# EAGLE design board (EAGLE 6.4)
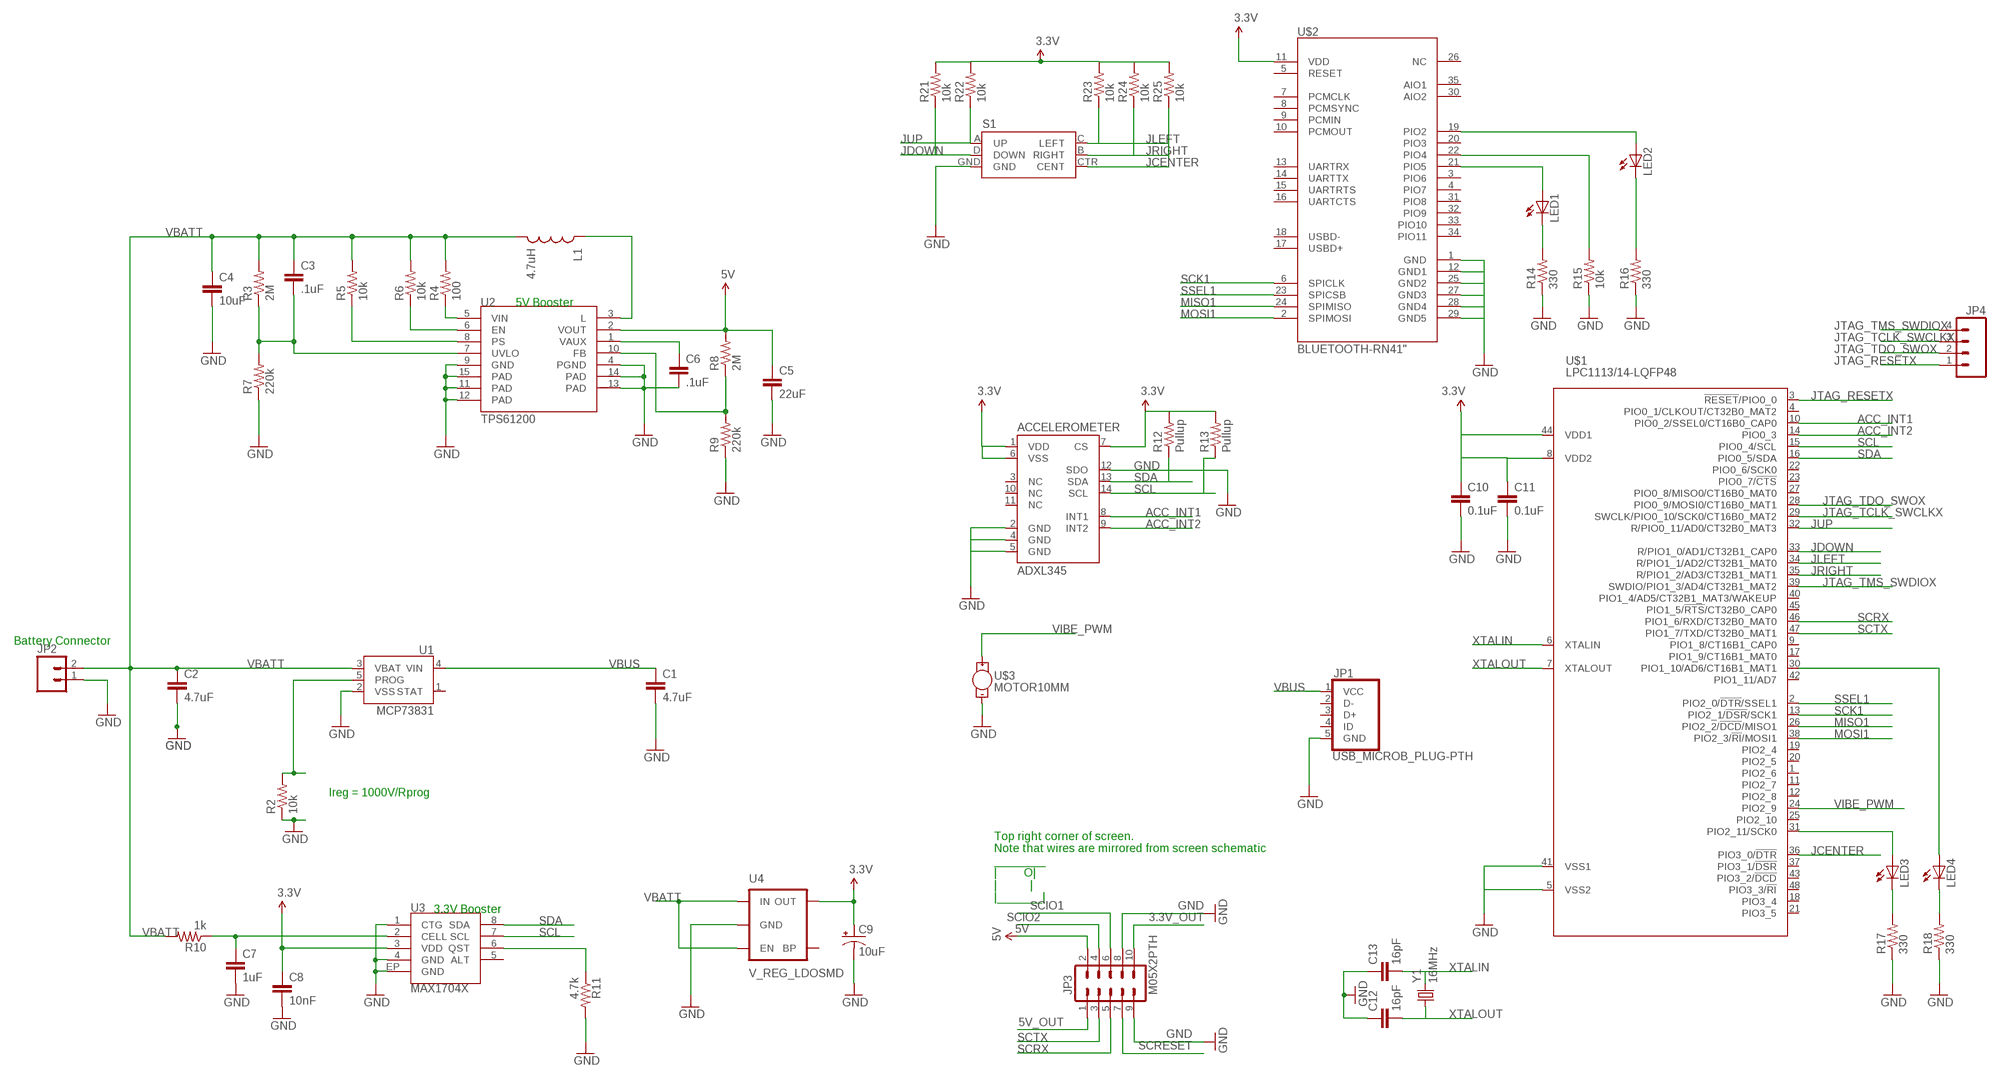
[diagram p0: schematic, sheet 1]

## Parts
ACCELEROMETER  ADXL345  [LGA14]
C1  4.7uF  CAP0402-CAP  [0402-CAP]
C2  4.7uF  CAP0402-CAP  [0402-CAP]
C3  .1uF  CAP0402-CAP  [0402-CAP]
C4  10uF  CAP0402-CAP  [0402-CAP]
C5  22uF  CAP0402-CAP  [0402-CAP]
C6  .1uF  CAP0402-CAP  [0402-CAP]
C7  1uF  CAP0402-CAP  [0402-CAP]
C8  10nF  CAP0402-CAP  [0402-CAP]
C9  10uF  10UF-TANT  [EIA3216]
C10  0.1uF  .1UF-CER  [0402-CAP]
C11  0.1uF  .1UF-CER  [0402-CAP]
C12  16pF  CAP0402-CAP  [0402-CAP]
C13  16pF  CAP0402-CAP  [0402-CAP]
JP1  USB_MICROB_PLUG-PTH  [MICRO-B-RA-TH]
JP2  M02-JST-2-PTH-NO_SILK  [JST-2-PTH-NS]
JP3  M05X2PTH  [AVR_ICSP]
JP4  M04POLAR  [MOLEX-1X4]
L1  4.7uH  INDUCTOR0402  [C0402]
LED1  LED0603  [LED-0603]
LED2  LED0603  [LED-0603]
LED3  LED0603  [LED-0603]
LED4  LED0603  [LED-0603]
R2  10k  RESISTOR0402-RES  [0402-RES]
R3  2M  RESISTOR0402-RES  [0402-RES]
R4  100  RESISTOR0402-RES  [0402-RES]
R5  10k  RESISTOR0402-RES  [0402-RES]
R6  10k  RESISTOR0402-RES  [0402-RES]
R7  220k  RESISTOR0402-RES  [0402-RES]
R8  2M  RESISTOR0402-RES  [0402-RES]
R9  220k  RESISTOR0402-RES  [0402-RES]
R10  1k  RESISTOR0402-RES  [0402-RES]
R11  4.7k  RESISTOR0402-RES  [0402-RES]
R12  Pullup  RESISTOR0402-RES  [0402-RES]
R13  Pullup  RESISTOR0402-RES  [0402-RES]
R14  330  RESISTOR0402-RES  [0402-RES]
R15  10k  RESISTOR0402-RES  [0402-RES]
R16  330  RESISTOR0402-RES  [0402-RES]
R17  330  RESISTOR0402-RES  [0402-RES]
R18  330  RESISTOR0402-RES  [0402-RES]
R21  10k  RESISTOR0402-RES  [0402-RES]
R22  10k  RESISTOR0402-RES  [0402-RES]
R23  10k  RESISTOR0402-RES  [0402-RES]
R24  10k  RESISTOR0402-RES  [0402-RES]
R25  10k  RESISTOR0402-RES  [0402-RES]
S1  JOYSTICK_MINI  [JOYSTICK_MINI]
U1  MCP73831  [SOT23-5]
U2  TPS61200  [QFN-10_PAD]
U3  MAX1704X  [TDFN-8]
U4  V_REG_LDOSMD  [SOT23-5]
U$1  LPC1113/14-LQFP48  [LQFP48]
U$2  BLUETOOTH-RN41"  [RN41]
U$3  MOTOR10MM  [VIBE-MOTOR-10MM]
Y1  16MHz  CRYSTAL5X3  [CRYSTAL-SMD-5X3]

## Nets
3.3V: ACCELEROMETER.1(VDD) ACCELEROMETER.6(VSS) ACCELEROMETER.7(CS) C8.1 C9.A(+) C10.1 C11.1 R12.2 R13.2 R21.2 R22.2 R23.2 R24.2 R25.2 U3.3(VDD) U4.5(OUT) U$1.8(VDD2) U$1.44(VDD1) U$2.11(VDD)
3.3V_OUT: JP3.10
5V: C5.1 JP3.2 R8.2 U2.2(VOUT)
5V_OUT: JP3.1
ACC_INT1: ACCELEROMETER.8(INT1) U$1.10(PIO0_2/SSEL0/CT16B0_CAP0)
ACC_INT2: ACCELEROMETER.9(INT2) U$1.14(PIO0_3)
GND: ACCELEROMETER.2(GND) ACCELEROMETER.4(GND) ACCELEROMETER.5(GND) ACCELEROMETER.12(SDO) C1.2 C2.2 C4.2 C5.2 C6.2 C7.2 C8.2 C9.C(-) C10.2 C11.2 C12.1 C13.1 JP1.5(GND) JP2.1 JP3.8 JP3.9 R2.1 R7.1 R9.1 R11.2 R14.1 R15.1 R16.1 R17.1 R18.1 S1.GND U1.2(VSS) U2.4(PGND) U2.9(GND) U2.11(PAD) U2.12(PAD) U2.13(PAD) U2.14(PAD) U2.15(PAD) U3.1(CTG) U3.4(GND) U3.EP(GND) U4.2(GND) U$1.5(VSS2) U$1.41(VSS1) U$2.1(GND) U$2.12(GND1) U$2.25(GND2) U$2.27(GND3) U$2.28(GND4) U$2.29(GND5) U$3.-
JCENTER: R25.1 S1.CTR(CENT) U$1.36(PIO3_0/!DTR!)
JDOWN: R21.1 S1.D(DOWN) U$1.33(R/PIO1_0/AD1/CT32B1_CAP0)
JLEFT: R23.1 S1.C(LEFT) U$1.34(R/PIO1_1/AD2/CT32B1_MAT0)
JRIGHT: R24.1 S1.B(RIGHT) U$1.35(R/PIO1_2/AD3/CT32B1_MAT1)
JTAG_RESETX: JP4.1 U$1.3(!RESET!/PIO0_0)
JTAG_TCLK_SWCLKX: JP4.3 U$1.29(SWCLK/PIO0_10/SCK0/CT16B0_MAT2)
JTAG_TDO_SWOX: JP4.2 U$1.28(PIO0_9/MOSI0/CT16B0_MAT1)
JTAG_TMS_SWDIOX: JP4.4 U$1.39(SWDIO/PIO1_3/AD4/CT32B1_MAT2)
JUP: R22.1 S1.A(UP) U$1.32(R/PIO0_11/AD0/CT32B0_MAT3)
MISO1: U$1.26(PIO2_2/!DCD!/MISO1) U$2.24(SPIMISO)
MOSI1: U$1.38(PIO2_3/!RI!/MOSI1) U$2.2(SPIMOSI)
N$1: LED2.A U$2.19(PIO2)
N$2: R2.2 U1.5(PROG)
N$3: C3.2 R3.1 R7.2 U2.7(UVLO)
N$4: C6.1 U2.1(VAUX)
N$5: R6.1 U2.6(EN)
N$6: R5.1 U2.8(PS)
N$7: L1.1 U2.3(L)
N$8: R8.1 R9.2 U2.10(FB)
N$9: C7.1 R10.1 U3.2(CELL)
N$10: R11.1 U3.6(QST)
N$11: R15.2 U$2.22(PIO4)
N$12: LED1.A U$2.21(PIO5)
N$13: LED1.C R14.2
N$14: LED2.C R16.2
N$15: LED3.A U$1.31(PIO2_11/SCK0)
N$16: LED4.A U$1.30(PIO1_10/AD6/CT16B1_MAT1)
N$17: LED3.C R17.2
N$18: LED4.C R18.2
SCIO1: JP3.6
SCIO2: JP3.4
SCK1: U$1.13(PIO2_1/!DSR!/SCK1) U$2.6(SPICLK)
SCL: ACCELEROMETER.14(SCL) R13.1 U3.7(SCL) U$1.15(PIO0_4/SCL)
SCRESET: JP3.7
SCRX: JP3.5 U$1.46(PIO1_6/RXD/CT32B0_MAT0)
SCTX: JP3.3 U$1.47(PIO1_7/TXD/CT32B0_MAT1)
SDA: ACCELEROMETER.13(SDA) R12.1 U3.8(SDA) U$1.16(PIO0_5/SDA)
SSEL1: U$1.2(PIO2_0/!DTR!/SSEL1) U$2.23(SPICSB)
VBATT: C2.1 C3.1 C4.1 JP2.2 L1.2 R3.2 R4.2 R5.2 R6.2 R10.2 U1.3(VBAT) U4.1(IN) U4.3(EN)
VBUS: C1.1 JP1.1(VCC) U1.4(VIN)
VIBE_PWM: U$1.24(PIO2_9) U$3.+
VIN: R4.1 U2.5(VIN)
XTALIN: C13.2 U$1.6(XTALIN) Y1.3
XTALOUT: C12.2 U$1.7(XTALOUT) Y1.1
Unconnected: ACCELEROMETER.3(NC) ACCELEROMETER.10(NC) ACCELEROMETER.11(NC) JP1.2(D-) JP1.3(D+) JP1.4(ID) U1.1(STAT) U3.5(ALT) U4.4(BP) U$1.1(PIO2_6) U$1.4(PIO0_1/CLKOUT/CT32B0_MAT2) U$1.9(PIO1_8/CT16B1_CAP0) U$1.11(PIO2_7) U$1.12(PIO2_8) U$1.17(PIO1_9/CT16B1_MAT0) U$1.18(PIO3_4) U$1.19(PIO2_4) U$1.20(PIO2_5) U$1.21(PIO3_5) U$1.22(PIO0_6/SCK0) U$1.23(PIO0_7/!CTS!) U$1.25(PIO2_10) U$1.27(PIO0_8/MISO0/CT16B0_MAT0) U$1.37(PIO3_1/!DSR!) U$1.40(PIO1_4/AD5/CT32B1_MAT3/WAKEUP) U$1.42(PIO1_11/AD7) U$1.43(PIO3_2/!DCD!) U$1.45(PIO1_5/!RTS!/CT32B0_CAP0) U$1.48(PIO3_3/!RI!) U$2.3(PIO6) U$2.4(PIO7) U$2.5(RESET) U$2.7(PCMCLK) U$2.8(PCMSYNC) U$2.9(PCMIN) U$2.10(PCMOUT) U$2.13(UARTRX) U$2.14(UARTTX) U$2.15(UARTRTS) U$2.16(UARTCTS) U$2.17(USBD+) U$2.18(USBD-) U$2.20(PIO3) U$2.26(NC) U$2.30(AIO2) U$2.31(PIO8) U$2.32(PIO9) U$2.33(PIO10) U$2.34(PIO11) U$2.35(AIO1)

## Notes on the sheet
- 5V Booster
- Battery Connector
- Ireg = 1000V/Rprog
- Top right corner of screen. 
  Note that wires are mirrored from screen schematic
  ________
  |         O|
  |           |
  |_______|
- 3.3V Booster

## Library data of the parts
ACCELEROMETER = SparkFun-Sensors:ADXL345: 3-axis SPI/I2C 2/4/8/16g accelerometer
C1-C8 C12 C13 = SparkFun-Passives:CAP: Capacitor Standard 0603 ceramic capacitor, and 0.1" leaded capacitor.
C9 = SparkFun-Capacitors:10UF-TANT: 10uF Tantalum SMT CAP-00811- 16V 10% (EIA-3216); PROD_ID: CAP-00811
C10 C11 = SparkFun-Capacitors:.1UF-CER: .1uF ceramic SMT CAP-00810- 25V +80%/-20% (0603) CAP-08390- 100V 10% (0603) CAP-08604- 25V 5% (0603); PROD_ID: CAP-00810
JP1 = SparkFun-Connectors:USB_MICROB_PLUG: USB Micro-B Plug Comes in a variety of packages. Check out Hirose's ZX-x0 line: http://www.hirose.co.jp/cataloge_hp/e24200011.pdf
JP2 = SparkFun-Connectors:M02: Header 2 Standard 2-pin 0.1" header. Use with straight break away headers (SKU : PRT-00116), right angle break away headers (PRT-00553), swiss pins (PRT-00743), machine pins (PRT-00117), and female headers (PRT-00115). Molex polarized connector foot print use with SKU : PRT-08233 with associated crimp pins and housings.
JP3 = SparkFun-Connectors:M05X2: Header 5x2 Standard 10-pin dual row 0.1" header. Commonly used with AVR-ISP. Use with Spark Fun Electronics SKU: PRT-00778
JP4 = SparkFun-Connectors:M04: Header 4 Standard 4-pin 0.1" header. Use with straight break away headers (SKU : PRT-00116), right angle break away headers (PRT-00553), swiss pins (PRT-00743), machine pins (PRT-00117), and female headers (PRT-00115). Molex polarized connector foot print use with SKU : PRT-08231 with associated crimp pins and housings. 1MM SMD Version SKU: PRT-10208
L1 = SparkFun-Passives:INDUCTOR: Inductors Basic Inductor/Choke - 0603 and 1206. Footprints are not proven and vary greatly between part numbers.
LED1-LED4 = SparkFun-LED:LED: LEDs Standard schematic elements and footprints for 5mm, 3mm, 1206, and 0603 sized LEDs. 5mm - Spark Fun Electronics SKU : COM-00529 (and others)
R2-R18 R21-R25 = SparkFun-Passives:RESISTOR: Resistor Basic schematic elements and footprints for 0603, 1206, and PTH resistors.
S1 = SparkFun-Electromechanical:JOYSTICK_MINI: Small 5-way tactile joystick, COM-10063 4UCON SF303GJ26
U1 = SparkFun-PowerIC:MCP73831: Miniature single cell, fully integrated Li-Ion, Li-polymer charge management controller http://ww1.microchip.com/downloads/en/DeviceDoc/21984a.pdf IC-09995; PROD_ID: IC-09995
U2 = SparkFun-PowerIC:TPS61200: DC to DC Booster IC-10035; PROD_ID: IC-10035
U3 = SparkFun-PowerIC:MAX1704X: MAX17043/MAX17044: Battery Fuel Guage (43 is 1cell, 44 is 2cell)
U4 = SparkFun-PowerIC:V_REG_LDO: Voltage Regulator LDO Standard 150mA LDO voltage regulator in SOT-23 layout. Micrel part MIC5205. BP (by-pass) pin is used to lower output noise with 470pF cap.
U$1 = lpc1100v1.1:LPC1113/14-LQFP48: NXP Semiconductors LPC11xx microcontrollers <http://ics.nxp.com/products/lpc1000/lpc11xx/> ARM 32-bit Cortex-M0 Microcontroller with MPU CPU clock up to 50MHz Up to 32KByte on-chip Flash ROM with In-System Programming (ISP) and In-Application Programming (IAP) via On-Chip Bootloader Up to 8KByte SRAM Nested Vectored Interrupt Controller Up to 2 SPI controllers UART with full Modem Interface and RS485 Support Fast Mode I2C-Bus 4 Timers with 4 capture channels and 13 output channels Watchdog (WDT) Sytem tick timer 10-bit ADC with 8 channels Power Management Unit (PMU) Brownout detection 12MHz internal RC oscillator Serial Wire Debug/Trace port
U$2 = SparkFun-RF:BLUETOOTH-RN41: Bluetooth SMD module
U$3 = SparkFun-Electromechanical:MOTOR: Vibration Motor- ROB-08449 Physical dimension and wire connections for this powerful vibration motor. Motor has a self adhesive backing.
Y1 = SparkFun-FreqCtrl:CRYSTAL: Various standard crystals. Proven footprints. Spark Fun Electronics SKU : COM-00534

## Board
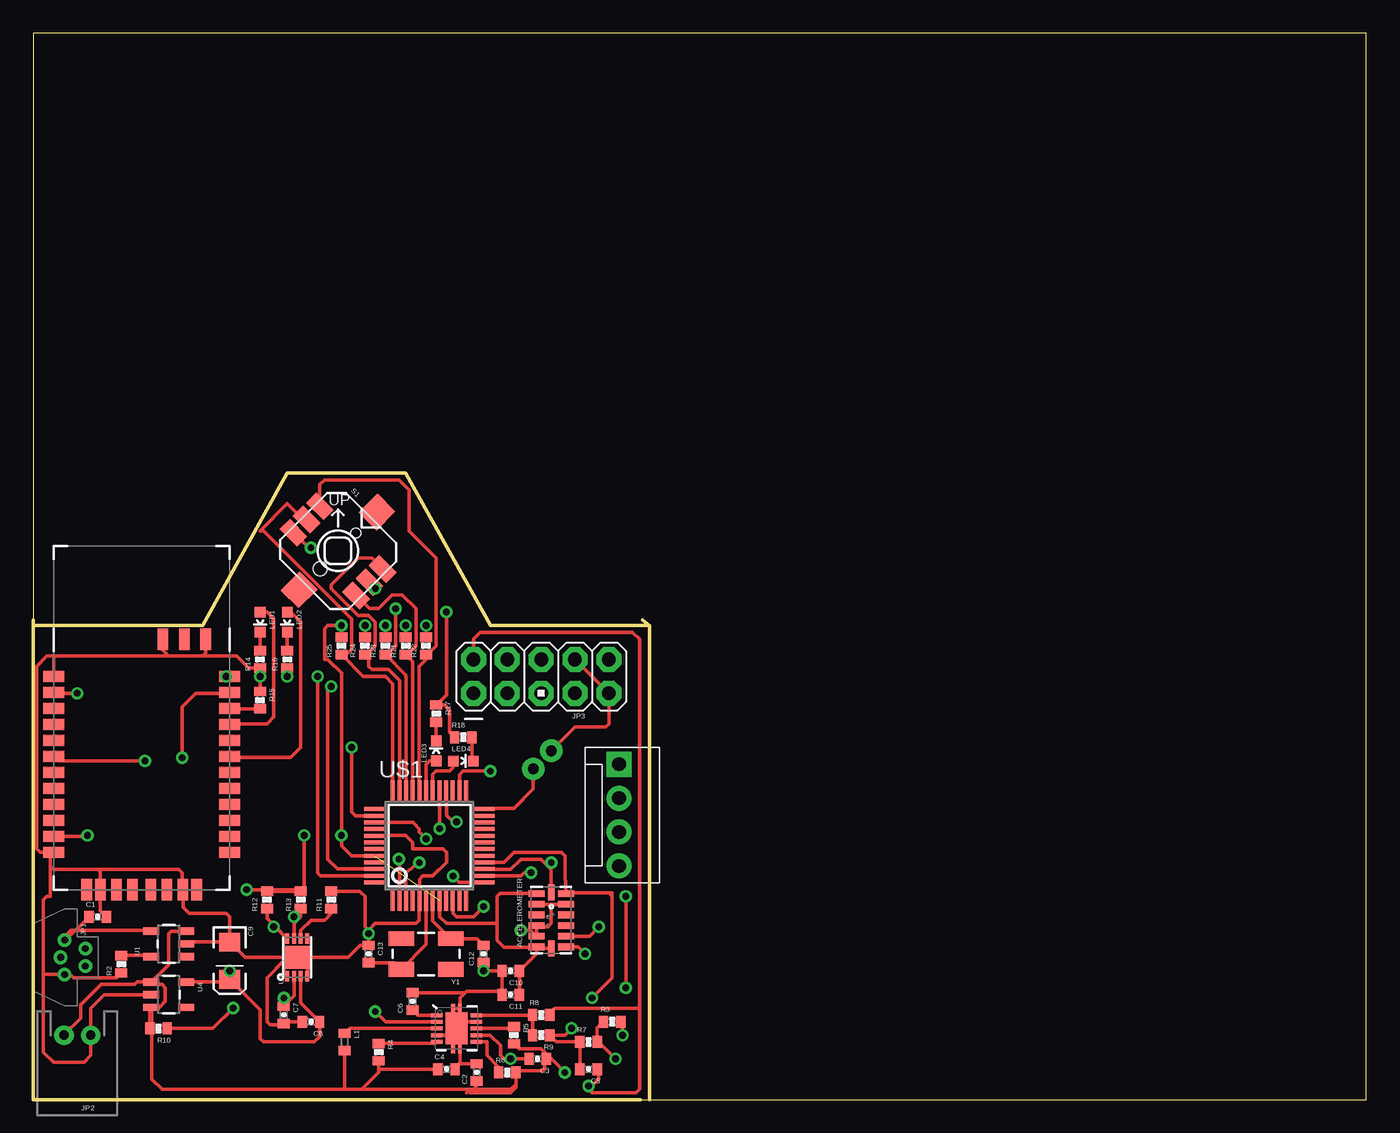
[diagram p1: board, top side]
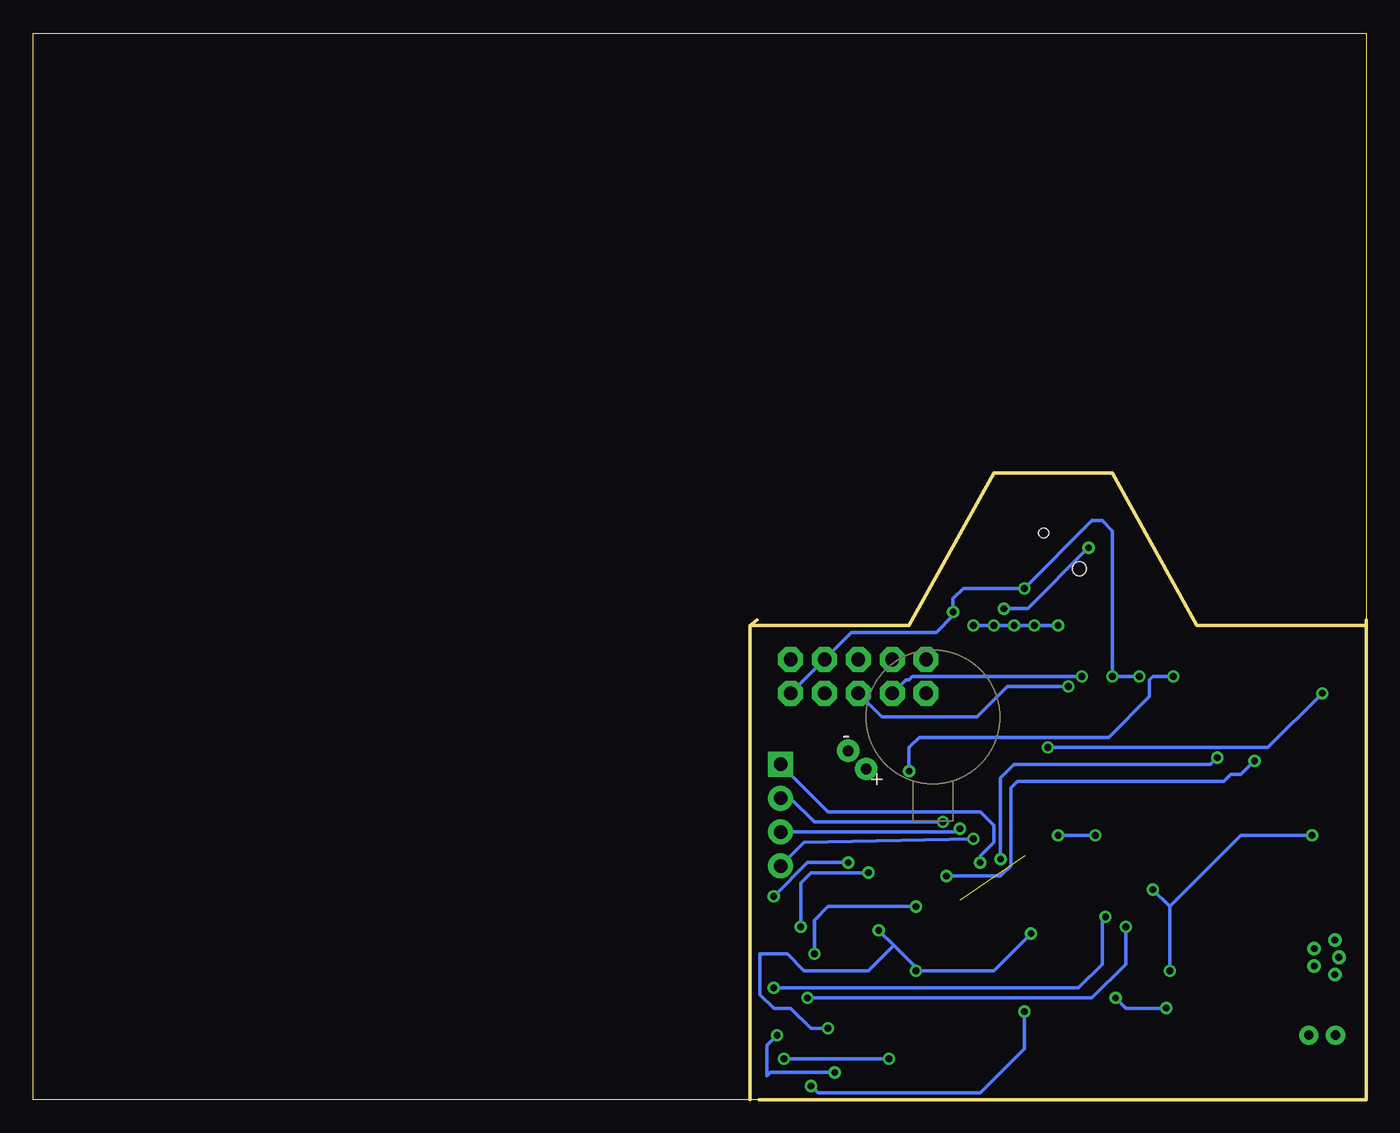
[diagram p2: board, bottom side, seen from below]

Size 100 x 80 mm. Coordinates in mm from the lower left corner, seen from the top.
Outline: 46.23,0 45.56,0 0,0 0,35.56
Outline: 46.23,0 100,0 100,80 0,80 0,36 0,35.56
Outline: 46.23,0 46.23,35.56
Outline: 46.23,35.56 45.72,36
Outline: 0,35.56 12.7,35.56 19.05,46.99 27.94,46.99 34.29,35.56 46.23,35.56
Copper layers (1*16): Top 0.035mm / dielectric 1.5mm / Bottom 0.035mm
Design rules "default": minimum track width 10mil, minimum drill 24mil, track to track 8mil, track to pad 8mil, pad to pad 8mil, via to via 8mil, smd to smd 8mil, copper to edge 40mil, drill to drill 8mil, minimum pad ring 10mil, minimum via ring 8mil, stop-mask expansion 4mil, vias tented up to drill 0mil, thermal gap 10mil

### Footprints (pad centres in the part's own frame; a part is rotated, then mirrored left to right if it is on the bottom)
LGA14 = smd 0.5 x 1.2: 1 2,1.1; 2 1.2,1.1; 3 0.4,1.1; 4 -0.4,1.1; 5 -1.2,1.1; 6 -2,1.1; 8 -2,-1.1; 9 -1.2,-1.1; 10 -0.4,-1.1; 11 0.4,-1.1; 12 1.2,-1.1; 13 2,-1.1 | smd 1.2 x 0.5: 7 -2.1,0; 14 2.1,0
0402-CAP = smd 0.7 x 0.9: 1 -0.65,0; 2 0.65,0
EIA3216 = smd 1.4 x 1.6: A 1.4,0; C -1.4,0
MICRO-B-RA-TH = drill 0.508 pad 0.9: 1 -1.3,-0.95; 2 -0.65,0.6; 3 0,-1.25; 4 0.65,0.6; 5 1.3,-0.95
JST-2-PTH-NS = drill 0.7 pad 1.448: 1 -1,0; 2 1,0
AVR_ICSP = drill 1.016 pad 1.88 octagon: 1 -1.27,5.08; 2 1.27,5.08; 3 -1.27,2.54; 4 1.27,2.54; 5 -1.27,0; 6 1.27,0; 7 -1.27,-2.54; 8 1.27,-2.54; 9 -1.27,-5.08; 10 1.27,-5.08
MOLEX-1X4 = drill 1.016 pad 1.88 square: 1 0,0 | drill 1.016 pad 1.88: 2 2.54,0; 3 5.08,0; 4 7.62,0
C0402 = smd 0.7 x 0.9: 1 -0.65,0; 2 0.65,0
LED-0603 = smd 0.8 x 0.8: A 0,-0.75; C 0,0.75
0402-RES = smd 0.7 x 0.9: 1 -0.65,0; 2 0.65,0
JOYSTICK_MINI = smd 1.85 x 1.1: A -3.325,1.4; B 3.325,1.4; C -3.325,-1.4; CTR -3.325,0; D 3.325,-1.4; GND 3.325,0 | smd 1.9 x 2: NC 0,4.13; NC@0 0,-4.13 | hole 0.75: 0,1.9 | hole 1.05: 0,-1.9
SOT23-5 = smd 0.55 x 1.2: 1 -0.95,-1.3; 2 0,-1.3; 3 0.95,-1.3; 4 0.95,1.3; 5 -0.95,1.3
QFN-10_PAD = smd 0.297 x 0.85: 1 -1,-1.475; 2 -0.5,-1.475; 3 0,-1.475; 4 0.5,-1.475; 5 1,-1.475; 6 1,1.475; 7 0.5,1.475; 8 0,1.475; 9 -0.5,1.475; 10 -1,1.475 | smd 0.7 x 0.28: 11 -1.5,0.25; 12 -1.5,-0.25; 13 1.5,0.25; 14 1.5,-0.25 | smd 2.4 x 1.65: 15 0,0
TDFN-8 = smd 0.8 x 0.3: 1 -1.4,0.75; 2 -1.4,0.25; 3 -1.4,-0.25; 4 -1.4,-0.75; 5 1.4,-0.75; 6 1.4,-0.25; 7 1.4,0.25; 8 1.4,0.75 | smd 1.73 x 1.88: EP 0,0
LQFP48 = smd 0.3 x 1.6: 1 -2.75,-4.1; 2 -2.25,-4.1; 3 -1.75,-4.1; 4 -1.25,-4.1; 5 -0.75,-4.1; 6 -0.25,-4.1; 7 0.25,-4.1; 8 0.75,-4.1; 9 1.25,-4.1; 10 1.75,-4.1; 11 2.25,-4.1; 12 2.75,-4.1; 25 2.75,4.1; 26 2.25,4.1; 27 1.75,4.1; 28 1.25,4.1; 29 0.75,4.1; 30 0.25,4.1; 31 -0.25,4.1; 32 -0.75,4.1; 33 -1.25,4.1; 34 -1.75,4.1; 35 -2.25,4.1; 36 -2.75,4.1 | smd 1.6 x 0.3: 13 4.1,-2.75; 14 4.1,-2.25; 15 4.1,-1.75; 16 4.1,-1.25; 17 4.1,-0.75; 18 4.1,-0.25; 19 4.1,0.25; 20 4.1,0.75; 21 4.1,1.25; 22 4.1,1.75; 23 4.1,2.25; 24 4.1,2.75; 37 -4.1,2.75; 38 -4.1,2.25; 39 -4.1,1.75; 40 -4.1,1.25; 41 -4.1,0.75; 42 -4.1,0.25; 43 -4.1,-0.25; 44 -4.1,-0.75; 45 -4.1,-1.25; 46 -4.1,-1.75; 47 -4.1,-2.25; 48 -4.1,-2.75
RN41 = smd 0.8 x 1.6: 1 -6.6,-6.6; 2 -5.4,-6.6; 3 -4.2,-6.6; 4 -3,-6.6; 5 -1.8,-6.6; 6 -0.6,-6.6; 7 0.6,-6.6; 8 1.8,-6.6; 9 3,-6.6; 10 4.2,-6.6; 11 5.4,-6.6; 12 6.6,-6.6; 13 6.6,6.6; 14 5.4,6.6; 15 4.2,6.6; 16 3,6.6; 17 1.8,6.6; 18 0.6,6.6; 19 -0.6,6.6; 20 -1.8,6.6; 21 -3,6.6; 22 -4.2,6.6; 23 -5.4,6.6; 24 -6.6,6.6 | smd 1.6 x 0.8: 25 -9.4,4.8; 26 -9.4,3.2; 27 -9.4,1.6; 28 9.4,3.1; 29 9.4,-3.1; 30 9.4,-4.122; 31 9.4,-1.9; 32 9.4,-0.7; 33 9.4,0.7; 34 9.4,1.9; 35 9.4,4.122
VIBE-MOTOR-10MM = drill 0.8 pad 1.676: + -5,-3.9; - -6.35,-2.54
CRYSTAL-SMD-5X3 = smd 1.9 x 1.1: 1 -1.85,-1.15; 2 1.85,-1.15; 3 1.85,1.15; 4 -1.85,1.15

### Placement (x,y rotation side)
ACCELEROMETER  38.86,13.46 90 top
C1  4.83,13.72 0 top
C2  33.27,2.03 90 top
C3  37.85,3.05 180 top
C4  30.99,2.29 0 top
C5  41.66,2.29 180 top
C6  28.45,7.37 90 top
C7  18.8,6.35 270 top
C8  20.83,5.84 180 top
C9  14.73,10.41 270 top
C10  35.81,9.65 180 top
C11  35.81,7.87 180 top
C12  33.78,10.92 90 top
C13  25.15,10.92 270 top
JP1  3.3,10.67 270 top
JP2  3.3,4.83 180 top
JP3  38.1,31.75 90 top
JP4  43.94,25.15 270 top
L1  23.37,4.32 270 top
LED1  17.02,35.81 180 top
LED2  19.05,35.81 180 top
LED3  30.23,26.16 0 top
LED4  32.26,25.4 270 top
R2  6.6,10.16 90 top
R3  43.43,5.84 0 top
R4  25.91,3.56 270 top
R5  36.07,4.83 270 top
R6  35.56,2.03 0 top
R7  41.66,4.32 0 top
R8  38.1,6.35 0 top
R9  38.1,4.83 180 top
R10  9.4,5.33 180 top
R11  22.35,14.99 90 top
R12  17.53,14.99 90 top
R13  20.07,14.99 90 top
R14  17.02,33.02 90 top
R15  17.02,29.97 270 top
R16  19.05,33.02 90 top
R17  30.23,28.96 270 top
R18  32.26,27.18 0 top
R21  27.94,34.04 90 top
R22  29.46,34.04 90 top
R23  26.42,34.04 90 top
R24  24.89,34.04 90 top
R25  23.11,34.04 90 top
S1  22.86,41.17 315 top
U1  10.16,11.68 90 top
U2  31.75,5.33 270 top
U3  19.81,10.67 90 top
U4  10.16,7.87 270 top
U$1  29.72,19.05 0 top
U$2  8.13,25.15 270 top
U$3  32.51,28.7 0 bottom
Y1  29.46,10.92 180 top

### Tracks (layer width: path | path; a pad name or v marks a point on that pad's centre or on a via)
3.3V  (via drill 0.51)  (1 unrouted)
  Top 0.254: R25.2 v23.11,35.56 22.1,35.56 21.84,35.31 21.84,33.02 22.1,33.02 23.11,32 v23.11,19.81 23.11,19.05 23.88,18.29 25.61,18.29 U$1.44 | v24.89,35.56 R24.2 | R23.2 v26.42,35.56 | R21.2 v27.94,35.56 | R22.2 v29.46,35.56 | C9.A 14.54,8.82 U4.5 | R12.2 R13.2 | U3.3 20.06,7.26 C8.1 21.48,4.71 21.08,4.32 17.27,4.32 17.02,4.57 17.02,6.73 C9.A | R13.2 19.95,15.75 v16,15.75 | v14.73,9.65 C9.A | v4.06,19.81 4,19.75 U$2.11 | R13.2 20.32,15.89 v20.32,19.81 | ACCELEROMETER.6 37.86,11.36 ACCELEROMETER.7 | ACCELEROMETER.6 37.73,11.43 35.31,11.43 34.8,11.94 34.8,13.21 | 34.8,13.21 34.8,15.24 35.02,15.46 ACCELEROMETER.1 | U$1.8 30.48,14.94 30.48,13.72 30.99,13.21 34.8,13.21 | ACCELEROMETER.6 37.76,10.95 C10.1 36.46,8.27 36.32,8.13 36.32,8.02 C11.1
  Bottom 0.254: v23.11,35.56 v24.89,35.56 v26.42,35.56 v27.94,35.56 v29.46,35.56 | v16,15.75 14.73,14.48 | 14.73,14.48 v14.73,9.65 | 14.73,14.48 9.4,19.81 v4.06,19.81 | v20.32,19.81 v23.11,19.81
5V  (via drill 0.51)
  Top 0.254: JP3.2 33.02,34.54 33.53,35.05 44.96,35.05 45.47,34.54 45.47,6.86 | 45.47,6.86 45.47,0.76 45.21,0.51 41.91,0.51 41.66,0.76 v41.66,1.02 41.91,1.02 42.42,1.52 42.42,2.17 C5.1 | U2.2 26.42,5.83 v25.65,6.6 | R8.2 38.75,6.49 39.12,6.86 45.47,6.86
  Bottom 0.254: v25.65,6.6 25.65,3.81 28.96,0.51 41.15,0.51 v41.66,1.02
ACC_INT1  (via drill 0.51)
  Top 0.254: U$1.10 31.5,14.98 | 31.5,14.98 31.5,14.99 | 31.5,14.98 31.5,13.97 31.75,13.72 33.02,13.72 v33.78,14.48 | v41.4,10.92 40.86,11.46 ACCELEROMETER.8
  Bottom 0.254: v33.78,14.48 40.39,14.48 41.4,13.46 v41.4,10.92
ACC_INT2  (via drill 0.51)
  Top 0.254: U$1.14 33.85,16.76 36.58,16.76 36.83,17.02 v37.34,17.02 | v42.42,12.95 41.73,12.26 ACCELEROMETER.9
  Bottom 0.254: v37.34,17.02 41.66,17.02 42.42,16.26 v42.42,12.95
GND  (via drill 0.51)
  Top 0.254: R14.1 17.02,32.51 | R15.1 v17.02,31.75 R14.1 | R14.1 16.14,32.37 15.24,33.27 12.7,33.27 | 12.7,33.27 10.16,33.27 | U$2.27 9.65,34.47 9.65,33.78 10.16,33.27 | U$2.25 12.93,33.5 12.7,33.27 | 10.16,33.27 1.52,33.27 | 1.52,33.27 1.02,33.27 0.25,32.51 0.25,18.8 0.5,18.55 U$2.12 1.27,18.29 1.27,17.53 | 1.27,17.53 1.27,15.24 1.02,15.24 0.76,14.99 0.76,9.4 | 4.83,17.27 5.03,17.07 U$2.29 5.03,14.16 C1.2 | 4.83,17.27 1.52,17.27 1.27,17.53 | R16.1 v19.05,31.75 | v25.65,38.35 25.21,38.8 S1.GND | JP2.1 4.32,4.81 | 4.32,4.81 4.32,3.3 3.81,2.79 1.52,2.79 0.76,3.56 0.76,9.4 | 0.76,9.4 2.32,9.4 JP1.5 2.82,9.37 3.05,9.14 6.24,9.14 R2.1 | 4.32,4.81 4.32,6.86 5.33,7.87 U4.2 | U1.2 11.59,11.81 C9.C | C9.C 14.73,13.72 14.48,13.97 11.68,13.97 11.23,14.43 U$2.28 11.18,15.8 11.18,17.02 10.92,17.27 4.83,17.27 | C9.C 15.88,10.67 18.8,10.67 | 18.8,10.67 U3.EP 20.57,10.67 | C8.2 18.94,5.84 C7.2 18.68,5.59 17.78,5.59 17.53,5.84 17.53,9.14 18.8,10.41 | U3.4 20.57,9.28 20.57,10.67 | U3.1 18.8,9.53 18.8,10.41 | 18.8,10.41 18.8,10.67 | R18.1 31.24,27.54 31.24,29.21 30.85,29.61 R17.1 30.99,30.37 v30.99,36.58 | JP3.8 JP3.9 43.18,28.19 42.93,27.94 40.64,27.94 U$3.- | U$2.1 1.52,33.27 | U$1.41 25.63,19.81 27.94,19.81 28.45,19.3 28.45,18.8 30.73,18.8 30.99,18.54 30.99,17.78 29.97,16.76 29.21,16.76 28.97,16.52 U$1.5 28.96,14.94 28.96,13.46 28.7,13.21 25.65,13.21 25.15,12.7 | 25.15,12.7 v25.15,12.45 C13.1 24.53,11.57 23.62,10.67 20.57,10.67 | C12.1 v33.78,9.65 C10.2 C11.2 34.91,8.13 32.51,8.13 32.4,8.02 | ACCELEROMETER.12 38.86,14.66 | 38.86,14.66 ACCELEROMETER.2 | 38.86,14.66 38.86,13.21 38.61,12.95 37.87,12.95 ACCELEROMETER.4 ACCELEROMETER.5 37.32,12.7 v36.58,12.7
  Top 0.254: 25.15,12.7 24.89,12.95 24.89,15.24 24.5,15.64 R11.2 | 32.4,8.02 32,7.62 U2.11 U2.12 31.5,5.58 U2.15 | U2.15 32.26,5.84 33.22,5.84 U2.9 | U2.15 31.75,5.08 31.5,4.83 | 31.5,4.83 30.28,4.83 U2.4 | U2.14 31.5,4.82 31.5,4.83 | C6.2 32.4,8.02 | U2.15 32,5.08 U2.13 32,2.79 31.64,2.43 C4.2 32.03,2.68 C2.2 | C5.2 R7.1 39.26,4.32 R9.1 39.88,4.83 v40.39,5.33
  Bottom 0.254: v17.02,31.75 v19.05,31.75 19.05,42.67 19.81,43.43 20.57,43.43 v25.65,38.35 30.23,38.35 30.99,37.59 v30.99,36.58 30.99,36.32 32.26,35.05 38.61,35.05 JP3.9 | v25.15,12.45 27.94,9.65 v33.78,9.65 33.78,9.91 35.43,11.56 | v36.58,12.7 35.43,11.56 | v40.39,5.33 41.66,5.33 43.18,6.86 44.45,6.86 45.47,7.87 45.47,10.92 43.43,10.92 42.16,9.65 37.34,9.65 35.43,11.56
JCENTER
  Top 0.254: U$1.36 26.97,31.2 26.42,31.75 24.75,31.75 R25.1 23.48,33.39 23.88,33.78 23.88,36.07 17.27,42.67 17.02,42.67 19.05,44.7 20.24,43.52 S1.CTR
JDOWN
  Top 0.254: U$1.33 28.47,32.86 R21.1 28.05,33.39 28.7,34.04 28.7,36.83 27.69,37.85 26.92,37.85 25.91,36.83 25.22,36.83 S1.D
JLEFT  (via drill 0.51)
  Top 0.254: v27.18,36.83 27.18,34.04 26.53,33.39 R23.1 27.94,31.86 27.94,31.75 27.97,31.72 U$1.34 | v20.83,41.4 20.64,41.4 S1.C
  Bottom 0.254: v27.18,36.83 25.4,36.83 v20.83,41.4
JRIGHT
  Top 0.254: U$1.35 27.47,31.46 26.67,32.26 25.4,32.26 25.15,32.51 25.15,33.13 R24.1 25,33.39 25.65,34.04 25.65,35.81 25.15,36.32 24.38,36.32 22.35,38.35 22.35,38.61 24.38,40.64 25.4,40.64 25.65,40.39 25.65,40.35 S1.B
JTAG_RESETX  (via drill 0.51)
  Top 0.254: v28.96,17.78 27.94,17.02 27.94,15.49 27.97,15.47 U$1.3
  Bottom 0.254: JP4.1 40.39,21.59 28.96,21.59 27.94,20.57 27.94,19.3 28.96,18.29 v28.96,17.78
JTAG_TCLK_SWCLKX  (via drill 0.51)
  Top 0.254: U$1.29 30.48,23.14 v30.48,20.32
  Bottom 0.254: v30.48,20.32 30.73,20.07 JP4.3
JTAG_TDO_SWOX  (via drill 0.51)
  Top 0.254: U$1.28 30.99,23.13 30.99,21.34 31.5,20.83 v31.75,20.83
  Bottom 0.254: v31.75,20.83 41.4,20.83 43.18,22.61 JP4.2
JTAG_TMS_SWDIOX  (via drill 0.51)
  Top 0.254: v29.46,19.56 28.96,20.07 28.96,20.32 28.48,20.8 U$1.39
  Bottom 0.254: JP4.4 42.16,19.3 v29.46,19.56
JUP
  Top 0.254: R22.1 29.58,33.39 30.23,34.04 30.23,40.64 28.19,42.67 28.19,45.72 27.43,46.48 21.84,46.48 21.5,46.14 S1.A | R22.1 | U$1.32 28.96,23.16 28.96,32.51 29.46,33.02 R22.1
MISO1  (via drill 0.51)
  Top 0.254: U$2.24 v14.48,31.75 | v34.29,24.64 32.26,24.64 31.97,24.35 U$1.26
  Bottom 0.254: v14.48,31.75 16,31.75 16.26,31.5 16.26,30.23 19.3,27.18 33.53,27.18 34.29,26.42 v34.29,24.64
MOSI1  (via drill 0.51)
  Top 0.254: U$2.2 1.59,30.48 v3.3,30.48 | v23.88,26.42 23.88,21.59 24.17,21.3 U$1.38
  Bottom 0.254: v3.3,30.48 7.37,26.42 v23.88,26.42
N$1
  Top 0.254: LED2.A 19.32,36.56 20.07,35.81 20.07,26.42 19.3,25.65 14.82,25.65 U$2.19
N$2
  Top 0.254: U1.5 8.78,10.81 R2.2
N$3  (via drill 0.51)
  Top 0.254: U2.7 34.28,4.83 35.05,4.06 35.05,3.3 35.31,3.05 v35.81,3.05 C3.2 | v43.69,3.05 42.42,4.32 R7.2 42.31,5.36 R3.1
  Bottom 0.254: v35.81,3.05 v43.69,3.05
N$4
  Top 0.254: U2.1 28.83,6.33 C6.1
N$5
  Top 0.254: R6.1 34.91,2.43 34.04,3.3 34.04,4.32 33.24,4.32 U2.6
N$6
  Top 0.254: U2.8 35.93,5.33 R5.1
N$7
  Top 0.254: U2.3 23.73,5.33 L1.1
N$8
  Top 0.254: U2.10 37.43,6.33 R8.1 R9.2
N$9  (via drill 0.51)
  Top 0.254: U3.2 19.56,7.77 C7.1 v18.8,7.62 | v14.99,6.86 13.46,5.33 R10.1
  Bottom 0.254: v18.8,7.62 18.03,6.86 v14.99,6.86
N$10
  Top 0.254: U3.6 20.07,12.7 20.83,13.46 21.84,13.46 22.35,13.97 R11.1
N$11
  Top 0.254: R15.2 14.75,29.32 U$2.22
N$12
  Top 0.254: LED1.A 17.54,36.56 18.03,36.07 18.03,28.7 17.53,28.19 14.78,28.19 U$2.21
N$13
  Top 0.254: R14.2 LED1.C
N$14
  Top 0.254: R16.2 LED2.C
N$15
  Top 0.254: U$1.31 29.46,25.15 29.73,25.41 LED3.A
N$16
  Top 0.254: U$1.30 29.97,24.38 30.23,24.64 31.24,24.64 31.51,24.9 LED4.A
N$17
  Top 0.254: R17.2 LED3.C
N$18
  Top 0.254: LED4.C 32.91,25.5 R18.2
SCK1  (via drill 0.51)
  Top 0.254: U$2.6 1.87,25.4 v8.38,25.4 | v31.5,16.76 31.96,16.3 U$1.13
  Bottom 0.254: v8.38,25.4 9.4,24.38 10.16,24.38 10.67,23.88 26.16,23.88 26.67,23.37 26.67,17.53 27.43,16.76 v31.5,16.76
SCL  (via drill 0.51)
  Top 0.254: U3.7 19.56,13.21 20.07,13.72 R13.1 19.56,13.83 v19.56,13.72 | U$1.15 33.85,17.27 35.81,17.27 36.58,18.03 38.1,18.03 38.86,17.27 ACCELEROMETER.14 v38.86,17.78 | v44.45,15.24 44.45,9.65 44.45,9.4 v44.45,8.38
  Bottom 0.254: v38.86,17.78 41.91,17.78 v44.45,15.24 | v19.56,13.72 19.81,13.46 19.81,10.16 21.59,8.38 v44.45,8.38
SCRX  (via drill 0.51)
  Top 0.254: v22.35,30.99 22.1,30.73 22.1,18.03 22.83,17.3 U$1.46
  Bottom 0.254: JP3.5 36.32,28.7 29.21,28.7 26.92,30.99 v22.35,30.99
SCTX  (via drill 0.51)
  Top 0.254: v21.34,31.75 21.34,17.02 21.55,16.8 U$1.47
  Bottom 0.254: JP3.3 34.54,31.5 34.29,31.5 34.04,31.75 v21.34,31.75
SDA  (via drill 0.51)
  Top 0.254: R12.1 17.53,13.6 U3.8 18.18,12.95 v18.03,12.95 | U$1.16 35.29,17.8 35.31,17.78 36.07,18.54 39.62,18.54 39.88,18.29 39.88,16.82 ACCELEROMETER.13 39.99,15.49 43.18,15.49 | 43.18,15.49 43.43,15.49 43.43,15.24 | 43.43,15.24 43.43,9.14 v41.91,7.62 | 43.18,15.49 43.43,15.24
  Bottom 0.254: v18.03,12.95 18.03,10.16 20.57,7.62 v41.91,7.62
SSEL1  (via drill 0.51)
  Top 0.254: U$2.23 14.66,30.48 12.19,30.48 11.18,29.46 v11.18,25.65 | v27.43,18.03 27.47,18 U$1.2
  Bottom 0.254: v11.18,25.65 11.68,25.15 26.42,25.15 27.43,24.13 v27.43,18.03
VBATT  (via drill 0.51)
  Top 0.254: JP2.2 2.29,4.84 3.56,6.11 3.56,7.11 5.08,8.64 7.62,8.64 7.81,8.82 U4.1 | U4.1 9.05,8.64 9.65,8.64 9.91,8.38 9.91,7.37 9.46,6.92 | 9.46,6.92 U4.3 8.75,6.81 R10.2 | U4.1 10.16,10.12 10.16,12.45 10.35,12.63 U1.3 | 9.46,6.92 9.4,6.86 8.64,6.86 8.89,6.6 8.89,1.52 9.65,0.76 23.37,0.76 | 23.37,0.76 24.64,0.76 | L1.2 23.37,0.76 | R4.2 25.91,2.29 | 25.91,2.29 25.91,2.03 24.64,0.76 | C4.1 25.91,2.29 | C2.1 33.27,1.02 33.02,0.76 32.51,0.76 | 32.51,0.76 24.64,0.76 | R6.2 36.21,0.9 35.81,0.51 32.77,0.51 32.51,0.76 | R6.2 36.21,1.16 35.81,0.76 32.77,0.76 32.51,0.51 | R6.2 36.07,2.17 38.24,2.17 38.35,2.29 38.35,2.91 C3.1 38.5,3.41 | 38.5,3.41 38.1,3.81 36.43,3.81 R5.2 | 38.5,3.41 v39.88,2.03 | v44.2,4.83 44.2,5.73 R3.2
  Bottom 0.254: v39.88,2.03 44.7,2.03 44.96,1.78 44.96,4.06 v44.2,4.83
VBUS
  Top 0.254: U1.4 8.79,12.7 2.79,12.7 2.35,12.26 JP1.1 2.43,11.97 C1.1
VIBE_PWM
  Top 0.254: U$1.24 33.86,21.84 36.07,21.84 37.51,23.29 U$3.+
VIN
  Top 0.254: R4.1 30.15,4.21 U2.5
XTALIN
  Top 0.254: C13.2 27.11,10.27 Y1.3 29.47,11.63 U$1.6
XTALOUT
  Top 0.254: C12.2 33.28,12.07 Y1.1 29.97,13.42 U$1.7